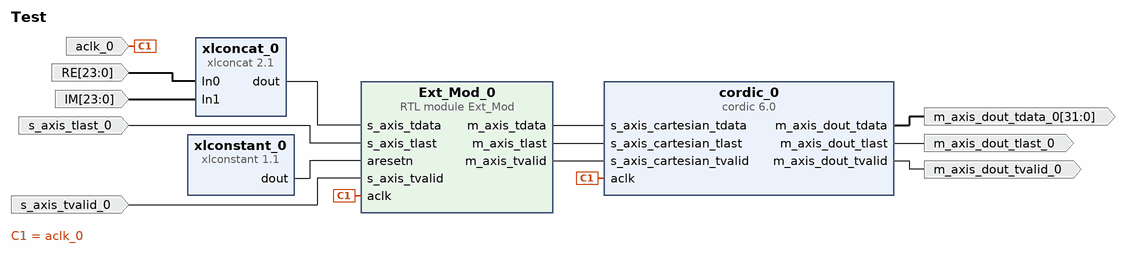
[diagram p0: block diagram of the top level]
# Vivado block design Test, xc7z020clg400-1, Vivado 2020.2
create_bd_design Test

create_bd_port -dir I -type clk aclk_0
create_bd_port -dir O -from 31 -to 0 m_axis_dout_tdata_0
create_bd_port -dir O m_axis_dout_tlast_0
create_bd_port -dir O m_axis_dout_tvalid_0
create_bd_port -dir I s_axis_tlast_0
create_bd_port -dir I s_axis_tvalid_0
create_bd_port -dir I -from 23 -to 0 RE
create_bd_port -dir I -from 23 -to 0 IM

create_bd_cell -type ip -vlnv xilinx.com:ip:cordic:6.0 cordic_0
set_property -dict [list \
  CONFIG.Coarse_Rotation false \
  CONFIG.Data_Format UnsignedInteger \
  CONFIG.Functional_Selection Square_Root \
  CONFIG.Input_Width 48 \
  CONFIG.Output_Width 25 \
  CONFIG.cartesian_has_tlast true \
  CONFIG.out_tlast_behv Pass_Cartesian_TLAST \
] [get_bd_cells cordic_0]
create_bd_cell -type ip -vlnv xilinx.com:ip:xlconstant:1.1 xlconstant_0
create_bd_cell -type ip -vlnv xilinx.com:ip:xlconcat:2.1 xlconcat_0
set_property -dict {CONFIG.IN0_WIDTH 24 CONFIG.IN1_WIDTH 24} [get_bd_cells xlconcat_0]
create_bd_cell -type module -reference Ext_Mod Ext_Mod_0

# ---- connections ----

connect_bd_net -net aclk_0_1 [get_bd_ports aclk_0] [get_bd_pins cordic_0/aclk] [get_bd_pins Ext_Mod_0/aclk]
connect_bd_net [get_bd_pins cordic_0/m_axis_dout_tdata] [get_bd_ports m_axis_dout_tdata_0]
connect_bd_net [get_bd_pins cordic_0/m_axis_dout_tlast] [get_bd_ports m_axis_dout_tlast_0]
connect_bd_net [get_bd_pins cordic_0/m_axis_dout_tvalid] [get_bd_ports m_axis_dout_tvalid_0]
connect_bd_net [get_bd_ports RE] [get_bd_pins xlconcat_0/In0]
connect_bd_net [get_bd_ports IM] [get_bd_pins xlconcat_0/In1]
connect_bd_net -net s_axis_tlast_0_1 [get_bd_ports s_axis_tlast_0] [get_bd_pins Ext_Mod_0/s_axis_tlast]
connect_bd_net -net s_axis_tvalid_0_1 [get_bd_ports s_axis_tvalid_0] [get_bd_pins Ext_Mod_0/s_axis_tvalid]
connect_bd_net [get_bd_pins xlconcat_0/dout] [get_bd_pins Ext_Mod_0/s_axis_tdata]
connect_bd_net [get_bd_pins Ext_Mod_0/m_axis_tdata] [get_bd_pins cordic_0/s_axis_cartesian_tdata]
connect_bd_net [get_bd_pins Ext_Mod_0/m_axis_tlast] [get_bd_pins cordic_0/s_axis_cartesian_tlast]
connect_bd_net [get_bd_pins Ext_Mod_0/m_axis_tvalid] [get_bd_pins cordic_0/s_axis_cartesian_tvalid]
connect_bd_net [get_bd_pins xlconstant_0/dout] [get_bd_pins Ext_Mod_0/aresetn]

validate_bd_design
save_bd_design
